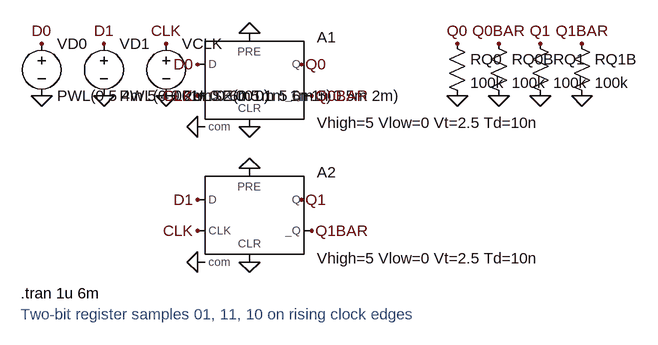
[diagram p0: schematic 15_dflop_register.asc]
15_dflop_register.asc, the LTspice schematic file:
Version 4
SHEET 1 1120 760
FLAG 80 96 D0
FLAG 80 176 0
FLAG 176 96 D1
FLAG 176 176 0
FLAG 272 96 CLK
FLAG 272 176 0
FLAG 320 128 D0
FLAG 320 176 CLK
FLAG 400 80 0
FLAG 400 224 0
FLAG 320 224 0
FLAG 480 128 Q0
FLAG 496 176 Q0BAR
FLAG 320 336 D1
FLAG 320 384 CLK
FLAG 400 288 0
FLAG 400 432 0
FLAG 320 432 0
FLAG 480 336 Q1
FLAG 496 384 Q1BAR
FLAG 720 96 Q0
FLAG 720 176 0
FLAG 784 96 Q0BAR
FLAG 784 176 0
FLAG 848 96 Q1
FLAG 848 176 0
FLAG 912 96 Q1BAR
FLAG 912 176 0
SYMBOL voltage 80 80 R0
SYMATTR InstName VD0
SYMATTR Value PWL(0 5 4m 5 4.001m 0 6m 0)
SYMBOL voltage 176 80 R0
SYMATTR InstName VD1
SYMATTR Value PWL(0 0 2m 0 2.001m 5 6m 5)
SYMBOL voltage 272 80 R0
SYMATTR InstName VCLK
SYMATTR Value PULSE(0 5 1m 1n 1n 0.5m 2m)
SYMBOL Digital\dflop 400 80 R0
SYMATTR InstName A1
SYMATTR Value Vhigh=5 Vlow=0 Vt=2.5 Td=10n
SYMBOL Digital\dflop 400 288 R0
SYMATTR InstName A2
SYMATTR Value Vhigh=5 Vlow=0 Vt=2.5 Td=10n
SYMBOL res 704 80 R0
SYMATTR InstName RQ0
SYMATTR Value 100k
SYMBOL res 768 80 R0
SYMATTR InstName RQ0B
SYMATTR Value 100k
SYMBOL res 832 80 R0
SYMATTR InstName RQ1
SYMATTR Value 100k
SYMBOL res 896 80 R0
SYMATTR InstName RQ1B
SYMATTR Value 100k
TEXT 48 480 Left 2 !.tran 1u 6m
TEXT 48 512 Left 2 ;Two-bit register samples 01, 11, 10 on rising clock edges

The netlist it stands for:
* 15_dflop_register.asc
VD0 D0 0 PWL(0 5 4m 5 4.001m 0 6m 0)
VD1 D1 0 PWL(0 0 2m 0 2.001m 5 6m 5)
VCLK CLK 0 PULSE(0 5 1m 1n 1n 0.5m 2m)
A1 D0 0 CLK 0 0 Q0BAR Q0 0 DFLOP Vhigh=5 Vlow=0 Vt=2.5 Td=10n
A2 D1 0 CLK 0 0 Q1BAR Q1 0 DFLOP Vhigh=5 Vlow=0 Vt=2.5 Td=10n
RQ0 Q0 0 100k
RQ0B Q0BAR 0 100k
RQ1 Q1 0 100k
RQ1B Q1BAR 0 100k
.tran 1u 6m
* Two-bit register samples 01, 11, 10 on rising clock edges
.backanno
.end